# EAGLE design Mother (EAGLE 7.4.0)
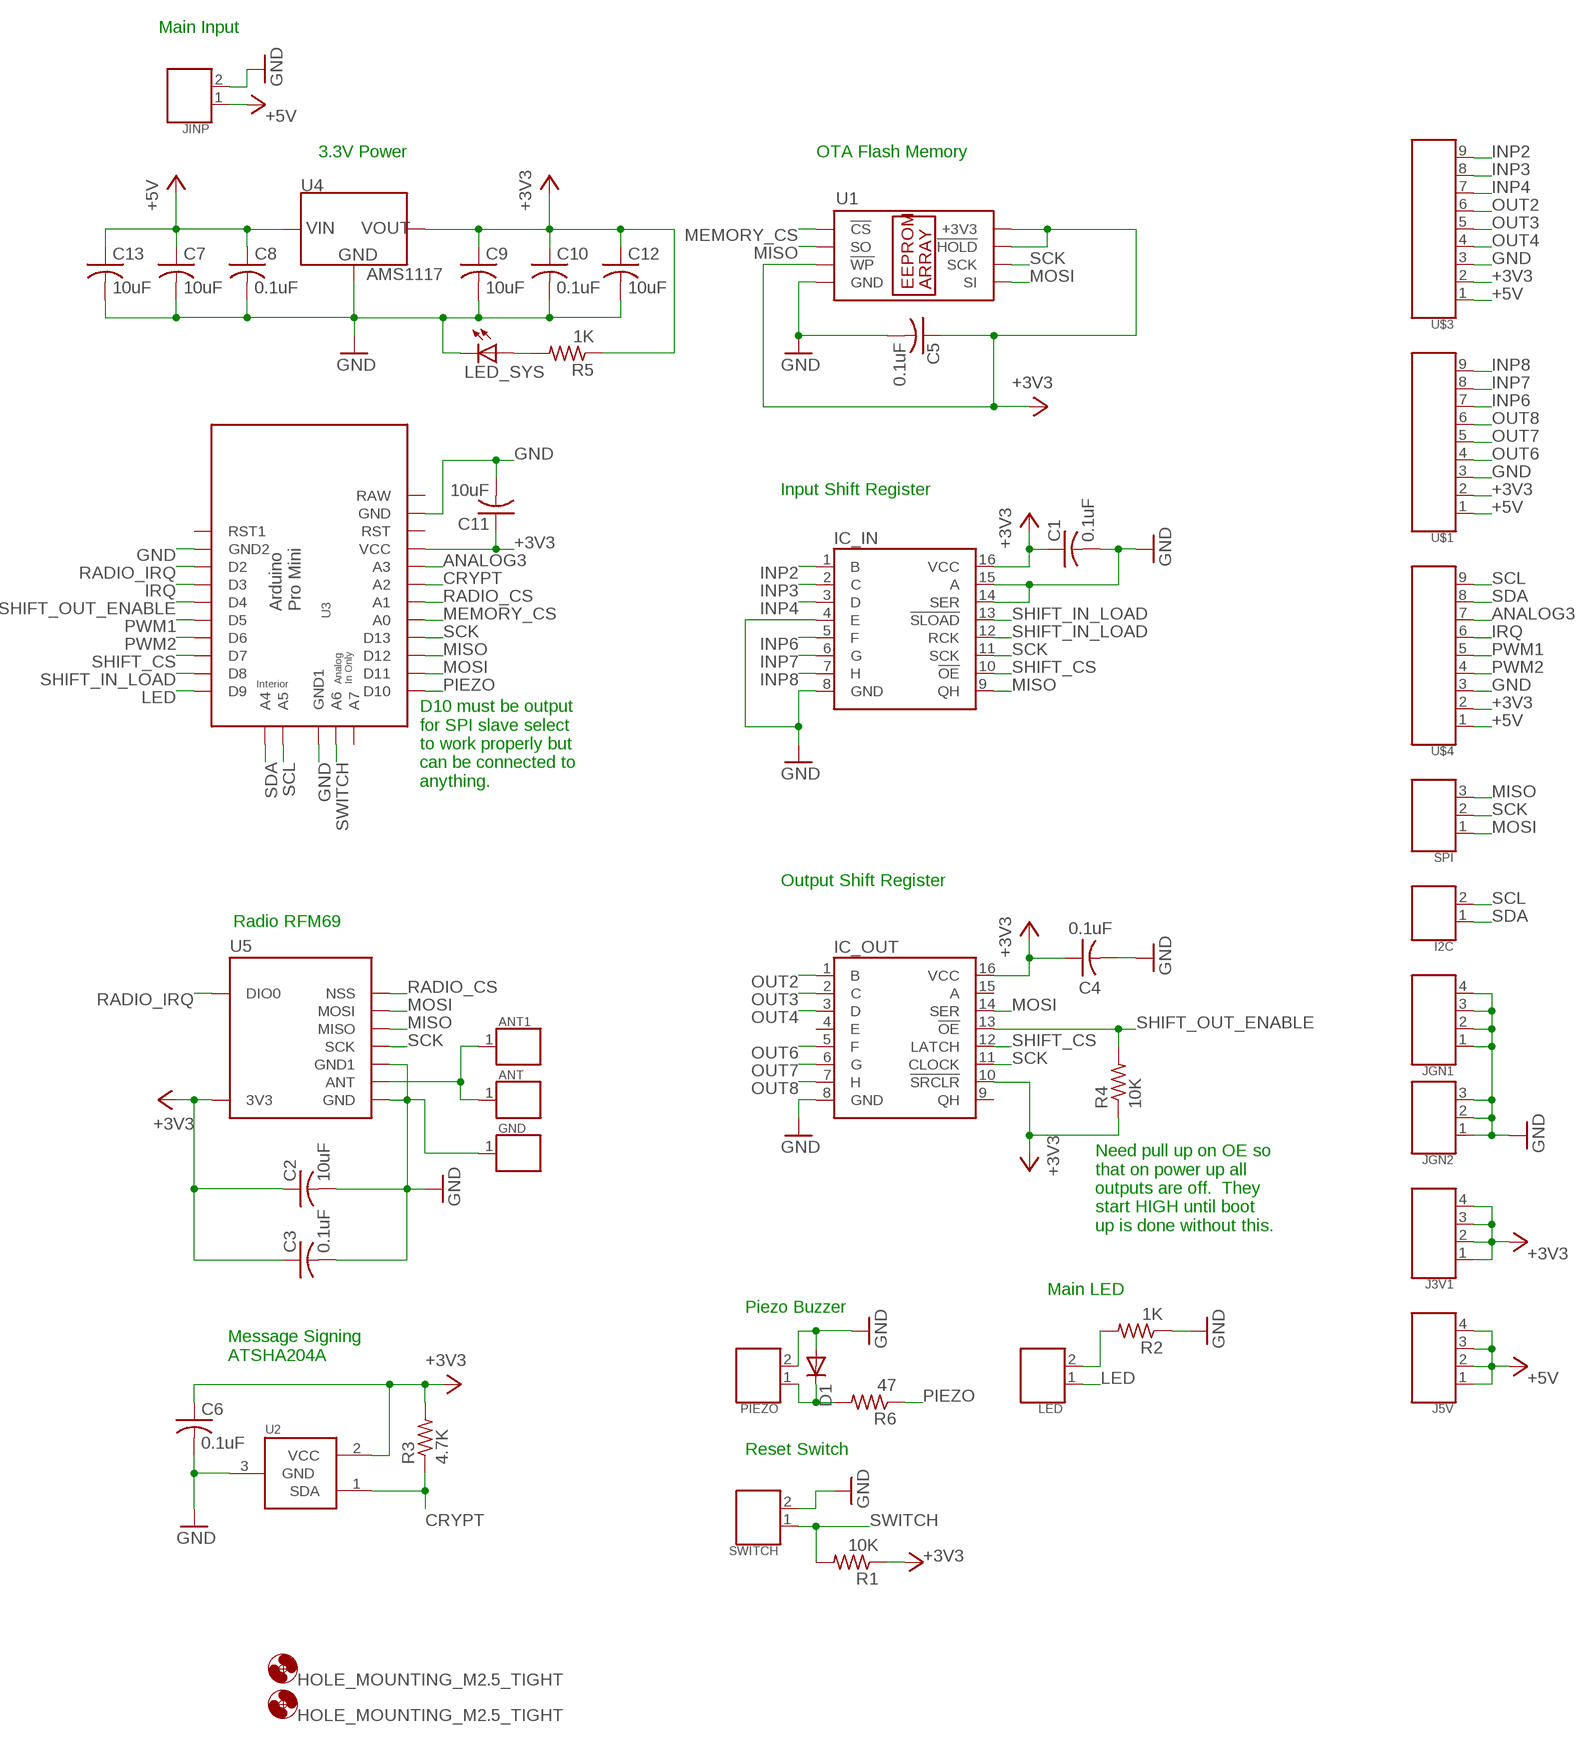
[diagram p0: schematic, sheet 1]

## Parts
ANT  CONNECTOR_1DUPONT  [DUPONT_1]
ANT1  CONNECTOR_1DUPONT  [DUPONT_1]
C1  0.1uF  CAP_0805  [CAP_0805]
C2  10uF  CAP_0805  [CAP_0805]
C3  0.1uF  CAP_0805  [CAP_0805]
C4  0.1uF  CAP_0805  [CAP_0805]
C5  0.1uF  CAP_0805  [CAP_0805]
C6  0.1uF  CAP_0805  [CAP_0805]
C7  10uF  CAP_0805  [CAP_0805]
C8  0.1uF  CAP_0805  [CAP_0805]
C9  10uF  CAP_0805  [CAP_0805]
C10  0.1uF  CAP_0805  [CAP_0805]
C11  10uF  CAP_0805  [CAP_0805]
C12  10uF  CAP_0805  [CAP_0805]
C13  10uF  CAP_0805  [CAP_0805]
D1  DIODESOD323  [SOD323]
GND  CONNECTOR_1DUPONT  [DUPONT_1]
H1  HOLE_MOUNTING_M2.5_TIGHT  [HOLE_M2.5PAN_TIGHT]
H2  HOLE_MOUNTING_M2.5_TIGHT  [HOLE_M2.5PAN_TIGHT]
I2C  CONNECTOR_2DUPONT  [DUPONT_2]
IC_IN  IC_MM74HC589SO16  [SO16]
IC_OUT  IC_SN74HC595  [SO16]
J3V1  CONNECTOR_4DUPONT  [DUPONT_4]
J5V  CONNECTOR_4DUPONT  [DUPONT_4]
JGN1  CONNECTOR_4DUPONT  [DUPONT_4]
JGN2  CONNECTOR_3DUPONT  [DUPONT_3]
JINP  CONNECTOR_2DUPONT  [DUPONT_2]
LED  CONNECTOR_2DUPONT  [DUPONT_2]
LED_SYS  LED  [LED_0805]
PIEZO  CONNECTOR_2DUPONT  [DUPONT_2]
R1  10K  R_0805  [R_0805]
R2  1K  R_0805  [R_0805]
R3  4.7K  R_0805  [R_0805]
R4  10K  R_0805  [R_0805]
R5  1K  R_0805  [R_0805]
R6  47  R_0805  [R_0805]
SPI  CONNECTOR_3DUPONT  [DUPONT_3]
SWITCH  CONNECTOR_2DUPONT  [DUPONT_2]
U1  IC_EEPROM  [SO-08]
U2  IC_ATSHA204A_CRYPT  [SOT23-3]
U3  ARD_PRO_MINI_CLONE_NOPROG  [PRO_MINI_CLONE_NO_PROG]
U4  AMS1117  IC_ASM1117_3.3V  [SOT223]
U5  RADIO_RFM69W_MIN_PAD  [RFM69W_MIN_PAD]
U$1  CONNECTOR_9DUP_MALE90  [DUPONT_MALE90_9]
U$3  CONNECTOR_9DUP_MALE90  [DUPONT_MALE90_9]
U$4  CONNECTOR_9DUPONT  [DUPONT_9]

## Nets
+3V3: C1.1 C2.1 C3.1 C4.1 C5.1 C6.1 C9.1 C10.1 C11.1 C12.1 IC_IN.16(VCC) IC_OUT.10(!SRCLR) IC_OUT.16(VCC) J3V1.1 J3V1.2 J3V1.3 J3V1.4 R1.1 R3.2 R4.1 R5.1 U1.3(!WP) U1.7(!HOLD) U1.8(+3V3) U2.2(VCC) U3.P$19(VCC) U4.2(VOUT) U4.4(VOUT) U5.8(3V3) U$1.2 U$3.2 U$4.2
+5V: C7.1 C8.1 C13.1 J5V.1 J5V.2 J5V.3 J5V.4 JINP.1 U4.3(VIN) U$1.1 U$3.1 U$4.1
ANALOG3: U3.P$18(A3) U$4.7
CRYPT: R3.1 U2.1(SDA) U3.P$17(A2)
GND: C1.2 C2.2 C3.2 C4.2 C5.2 C6.2 C7.2 C8.2 C9.2 C10.2 C11.2 C12.2 C13.2 D1.A GND.1 IC_IN.4(E) IC_IN.8(GND) IC_IN.14(SER) IC_IN.15(A) IC_OUT.8(GND) JGN1.1 JGN1.2 JGN1.3 JGN1.4 JGN2.1 JGN2.2 JGN2.3 JINP.2 LED_SYS.2(C) PIEZO.2 R2.1 SWITCH.2 U1.4(GND) U2.3(GND) U3.P$2(GND2) U3.P$21(GND) U3.P$27(GND1) U4.1(GND) U5.9(GND) U5.11(GND1) U$1.3 U$3.3 U$4.3
INP2: IC_IN.1(B) U$3.9
INP3: IC_IN.2(C) U$3.8
INP4: IC_IN.3(D) U$3.7
INP6: IC_IN.5(F) U$1.7
INP7: IC_IN.6(G) U$1.8
INP8: IC_IN.7(H) U$1.9
IRQ: U3.P$4(D3) U$4.6
LED: LED.1 U3.P$10(D9)
MEMORY_CS: U1.1(!CS) U3.P$15(A0)
MISO: IC_IN.9(QH) SPI.3 U1.2(SO) U3.P$13(D12) U5.13(MISO)
MOSI: IC_OUT.14(SER) SPI.1 U1.5(SI) U3.P$12(D11) U5.14(MOSI)
N$1: LED.2 R2.2
N$2: LED_SYS.1(A) R5.2
N$3: D1.C PIEZO.1 R6.2
N$11: ANT1.1 ANT.1 U5.10(ANT)
OUT2: IC_OUT.1(B) U$3.6
OUT3: IC_OUT.2(C) U$3.5
OUT4: IC_OUT.3(D) U$3.4
OUT6: IC_OUT.5(F) U$1.4
OUT7: IC_OUT.6(G) U$1.5
OUT8: IC_OUT.7(H) U$1.6
PIEZO: R6.1 U3.P$11(D10)
PWM1: U3.P$6(D5) U$4.5
PWM2: U3.P$7(D6) U$4.4
RADIO_CS: U3.P$16(A1) U5.15(NSS)
RADIO_IRQ: U3.P$3(D2) U5.2(DIO0)
SCK: IC_IN.11(SCK) IC_OUT.11(CLOCK) SPI.2 U1.6(SCK) U3.P$14(D13) U5.12(SCK)
SCL: I2C.2 U3.P$24(A5) U$4.9
SDA: I2C.1 U3.P$23(A4) U$4.8
SHIFT_CS: IC_IN.10(!OE) IC_OUT.12(LATCH) U3.P$8(D7)
SHIFT_IN_LOAD: IC_IN.12(RCK) IC_IN.13(!SLOAD) U3.P$9(D8)
SHIFT_OUT_ENABLE: IC_OUT.13(!OE) R4.2 U3.P$5(D4)
SWITCH: R1.2 SWITCH.1 U3.P$26(A6)
Unconnected: IC_OUT.4(E) IC_OUT.9(QH) IC_OUT.15(A) U3.P$1(RST1) U3.P$20(RST) U3.P$25(A7)

## Notes on the sheet
- Main Input
- 3.3V Power | OTA Flash Memory
- Input Shift Register
- D10 must be output
  for SPI slave select
  to work properly but
  can be connected to
  anything.
- Output Shift Register
- Radio RFM69
- Need pull up on OE so
  that on power up all
  outputs are off.  They
  start HIGH until boot
  up is done without this.
- Main LED
- Piezo Buzzer
- Message Signing
  ATSHA204A
- Reset Switch

## Power pins joined to a net without a drawn wire
RAW: U3.P$22(RAW)

## Library data of the parts
ANT ANT1 GND = TD22057:CONNECTOR_1
C1-C13 = TD22057:CAP_0805
D1 = TD22057:DIODE: DIODE high speed (Philips)
H1 H2 = TD22057:HOLE_MOUNTING: MOUNTING HOLE with drill center marker
I2C JINP LED PIEZO SWITCH = TD22057:CONNECTOR_2: 2 Pin connector
IC_IN = TD22057:IC_MM74HC589: MM74HC589 shift input register with SPI support
IC_OUT = TD22057:IC_SN74HC595: SN74Hc595 8 bit ouput shift register Ground: GND, OE VCC: VCC clear all: SRCLR to GND, SRCLR to VCC to use
J3V1 J5V JGN1 = TD22057:CONNECTOR_4
JGN2 SPI = TD22057:CONNECTOR_3
LED_SYS = TD22057:LED
R1-R6 = TD22057:R_0805
U1 = TD22057:IC_EEPROM
U2 = TD22057:IC_ATSHA204A_CRYPT
U3 = TD22057:ARD_PRO_MINI_CLONE_NOPROG: ABK Pro-Mini Arduino Clone
U4 = TD22057:IC_ASM1117_3.3V: ICP006
U5 = TD22057:RADIO_RFM69W_MIN_PAD
U$1 U$3 U$4 = TD22057:CONNECTOR_9

## Board
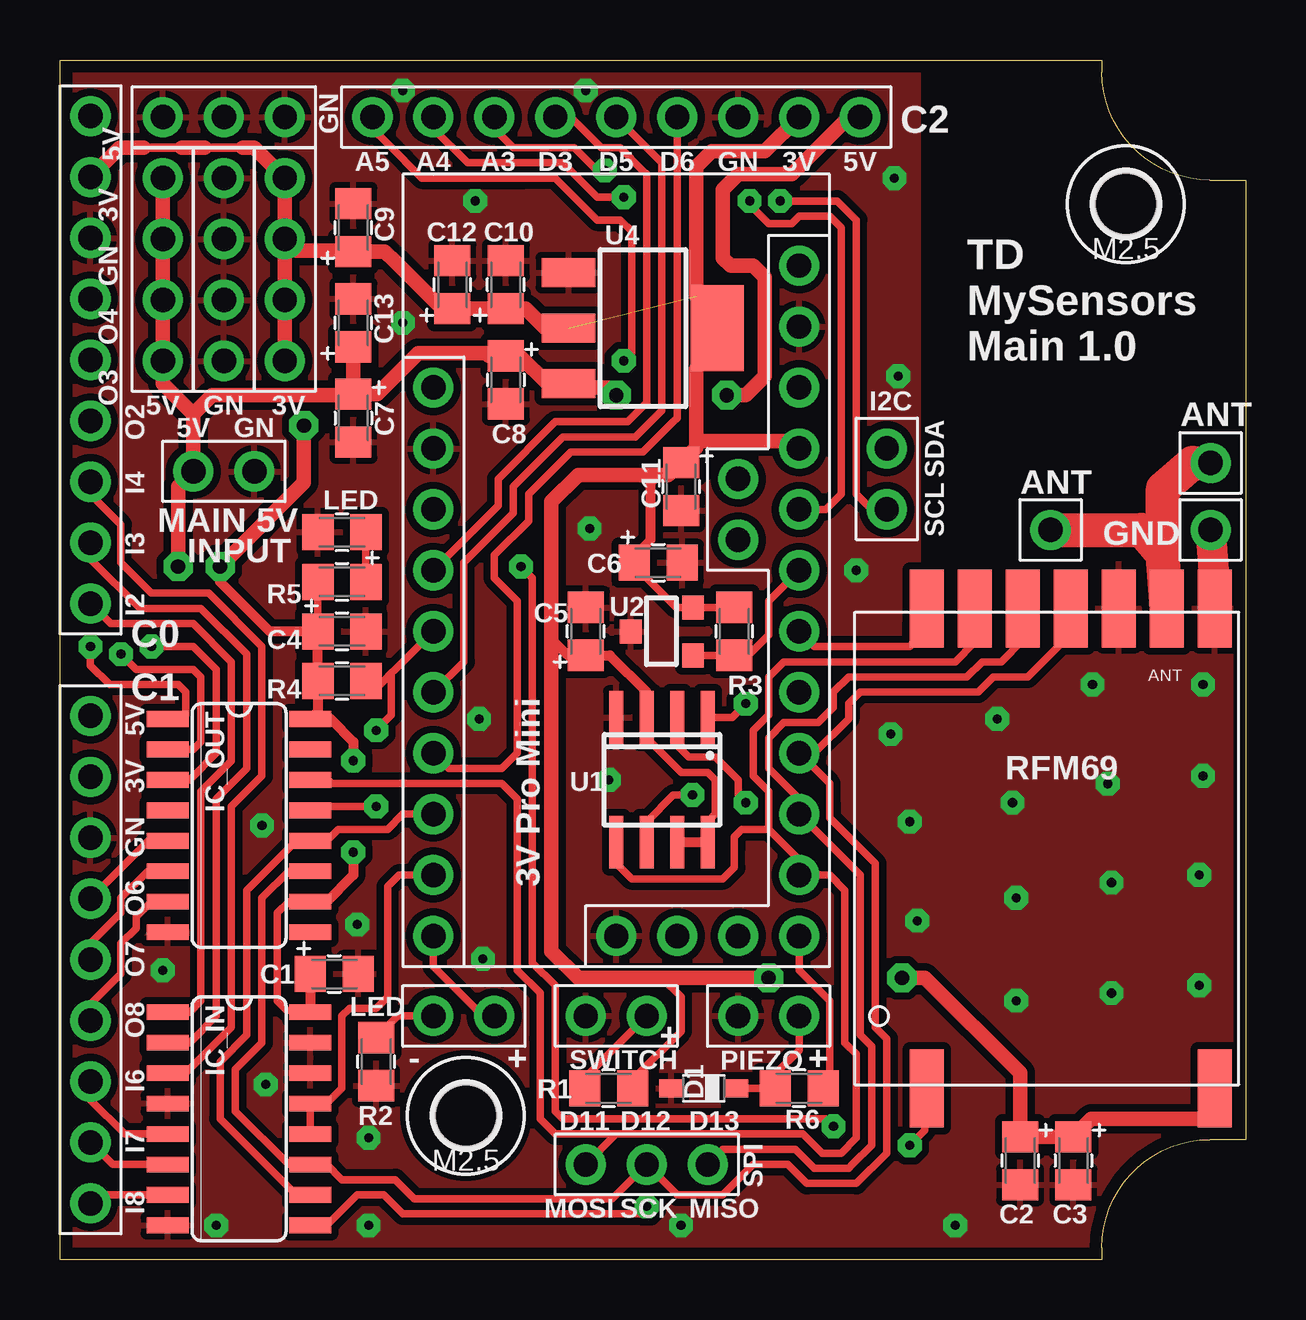
[diagram p1: board, top side]
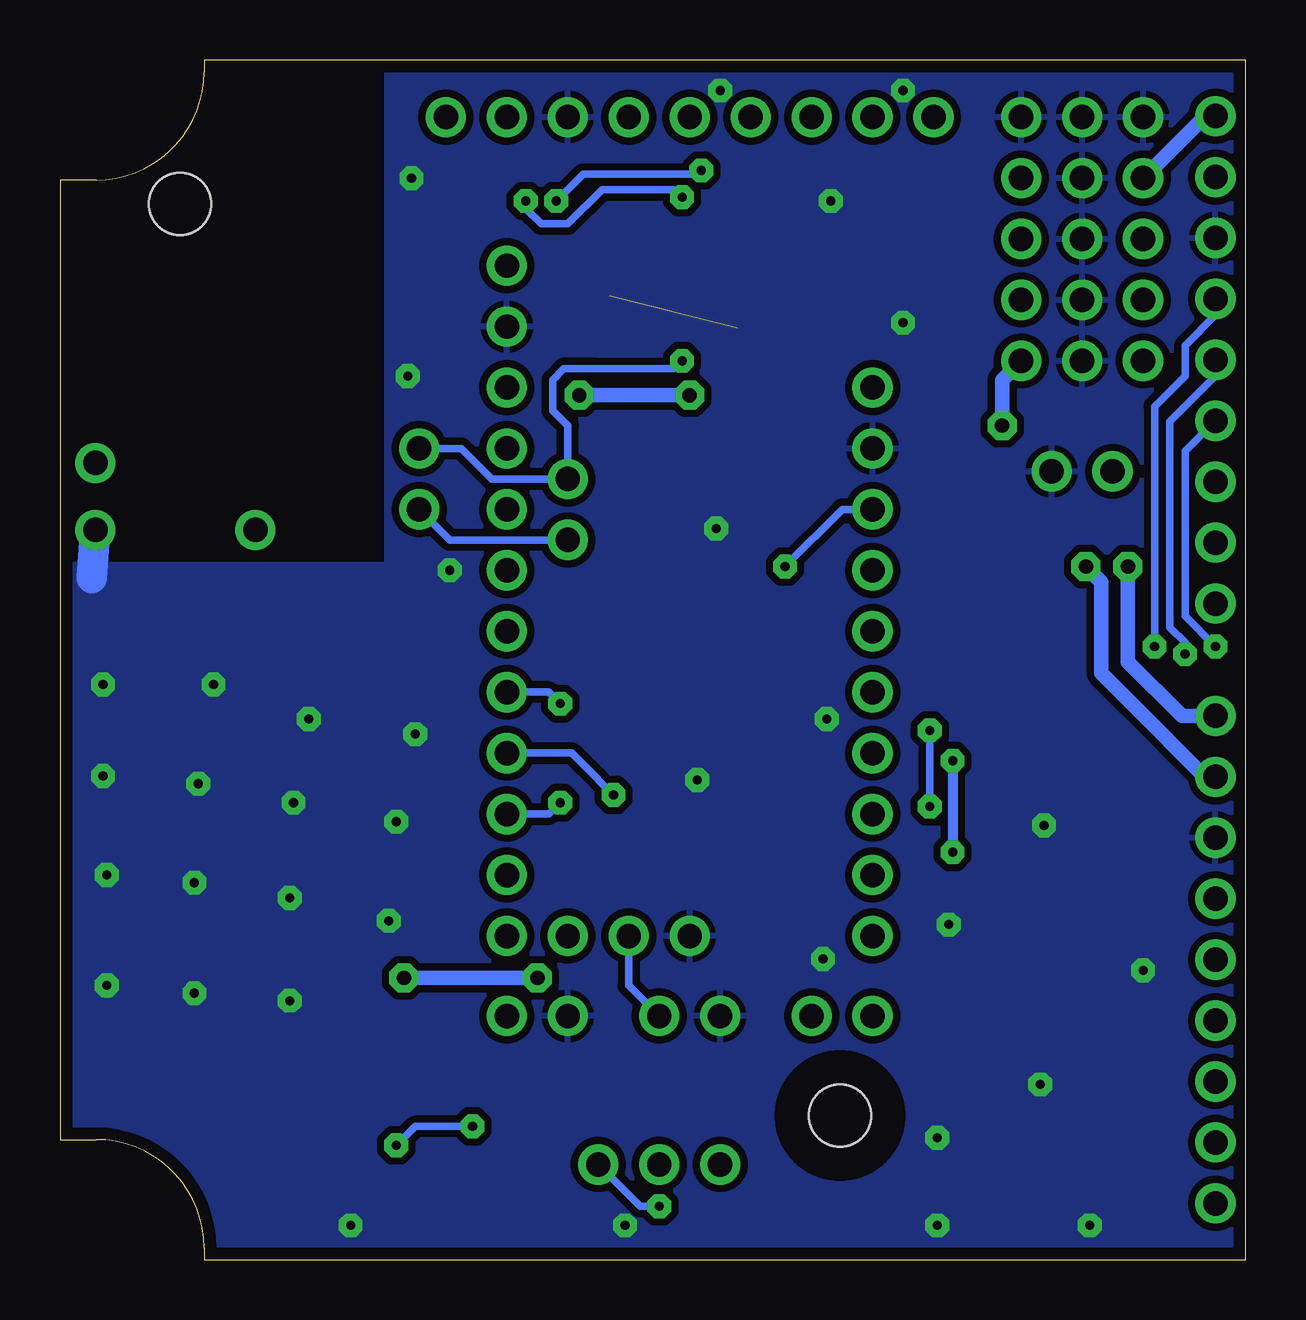
[diagram p2: board, bottom side, seen from below]

Size 49.41 x 50.01 mm. Coordinates in mm from the lower left corner, seen from the top.
Outline: 43.42,0.51 arc-90 47.92,5.01 49.42,5.01 49.42,45.01 47.92,45.01 arc-90 43.42,49.51 43.42,50.01 0,50.01 0,0 43.42,0 43.42,0.51
Copper layers (1*2*15*16): Top 0.035mm / dielectric 0.2mm / layer 2 0.035mm / dielectric 1.2mm / layer 15 0.035mm / dielectric 0.2mm / Bottom 0.035mm
Design rules "tight_electrow_spark": minimum track width 8mil, minimum drill 14mil, track to track 12mil, track to pad 10mil, pad to pad 12mil, via to via 10mil, smd to smd 10mil, copper to edge 20mil, drill to drill 12mil, minimum pad ring 12mil, minimum via ring 12mil, stop-mask expansion 0mil, vias tented up to drill 100mil, thermal gap 10mil

### Footprints (pad centres in the part's own frame; a part is rotated, then mirrored left to right if it is on the bottom)
DUPONT_1 = drill 1.016 pad 1.676: 1 0,0
CAP_0805 = smd 1.3 x 1.5: 1 -1,0; 2 1,0
SOD323 = smd 1 x 0.75: A 1.35,0; C -1.35,0
HOLE_M2.5PAN_TIGHT = hole 2.6: 0,0
DUPONT_2 = drill 1.016 pad 1.676: 1 -1.27,0; 2 1.27,0
SO16 = smd 0.66 x 1.75: 1 -4.445,-2.973; 2 -3.175,-2.973; 3 -1.905,-2.973; 4 -0.635,-2.973; 5 0.635,-2.973; 6 1.905,-2.973; 7 3.175,-2.973; 8 4.445,-2.973; 9 4.445,2.973; 10 3.175,2.973; 11 1.905,2.973; 12 0.635,2.973; 13 -0.635,2.973; 14 -1.905,2.973; 15 -3.175,2.973; 16 -4.445,2.973
DUPONT_4 = drill 1.016 pad 1.676: 1 -3.81,0; 2 -1.27,0; 3 1.27,0; 4 3.81,0
DUPONT_3 = drill 1.016 pad 1.676: 1 -2.54,0; 2 0,0; 3 2.54,0
LED_0805 = smd 1.3 x 1.5: 1 -1,0; 2 1,0
R_0805 = smd 1.3 x 1.5: 1 -1,0; 2 1,0
SO-08 = smd 0.6 x 2.2: 1 -1.905,-2.6; 2 -0.635,-2.6; 3 0.635,-2.6; 4 1.905,-2.6; 5 1.905,2.6; 6 0.635,2.6; 7 -0.635,2.6; 8 -1.905,2.6
SOT23-3 = smd 1 x 0.9: 1 -1,-1.3; 2 1,-1.3; 3 0,1.3
PRO_MINI_CLONE_NO_PROG = drill 1.016 pad 1.676: P$1 0,22.86; P$2 0,20.32; P$3 0,17.78; P$4 0,15.24; P$5 0,12.7; P$6 0,10.16; P$7 0,7.62; P$8 0,5.08; P$9 0,2.54; P$10 0,0; P$11 15.24,0; P$12 15.24,2.54; P$13 15.24,5.08; P$14 15.24,7.62; P$15 15.24,10.16; P$16 15.24,12.7; P$17 15.24,15.24; P$18 15.24,17.78; P$19 15.24,20.32; P$20 15.24,22.86; P$21 15.24,25.4; P$22 15.24,27.94; P$23 12.7,16.51; P$24 12.7,19.05; P$25 12.7,0; P$26 10.16,0; P$27 7.62,0
SOT223 = smd 1.219 x 2.235: 1 -2.311,-3.099; 2 0,-3.099; 3 2.311,-3.099 | smd 3.6 x 2.2: 4 0,3.099
RFM69W_MIN_PAD = smd 3.25 x 1.4: 2 -10,5; 8 -10,-7; 9 10,-7; 10 10,-5; 11 10,-3; 12 10,-1; 13 10,1; 14 10,3; 15 10,5
DUPONT_MALE90_9 = drill 1.016 pad 1.676: 1 -10.16,0; 2 -7.62,0; 3 -5.08,0; 4 -2.54,0; 5 0,0; 6 2.54,0; 7 5.08,0; 8 7.62,0; 9 10.16,0
DUPONT_9 = drill 1.016 pad 1.676: 1 -10.16,0; 2 -7.62,0; 3 -5.08,0; 4 -2.54,0; 5 0,0; 6 2.54,0; 7 5.08,0; 8 7.62,0; 9 10.16,0

### Placement (x,y rotation side)
ANT  47.94,33.21 0 top
ANT1  41.28,30.42 0 top
C1  11.43,11.91 0 top
C2  40.01,4.13 270 top
C3  42.23,4.13 270 top
C4  11.75,26.19 0 top
C5  21.91,26.19 90 top
C6  24.92,29.05 0 top
C7  12.22,35.08 270 top
C8  18.57,36.67 270 top
C9  12.22,43.02 90 top
C10  18.57,40.64 90 top
C11  25.88,32.23 270 top
C12  16.35,40.64 90 top
C13  12.22,39.05 90 top
D1  26.83,7.14 180 top
GND  47.94,30.42 0 top
H1  16.91,6.01 0 top
H2  44.41,44.01 0 top
I2C  34.45,32.54 90 top
IC_IN  7.46,5.87 270 top
IC_OUT  7.46,18.1 270 top
J3V1  9.37,41.27 270 top
J5V  4.29,41.27 90 top
JGN1  6.83,41.27 90 top
JGN2  6.83,47.62 0 top
JINP  6.83,32.86 0 top
LED  16.83,10.16 180 top
LED_SYS  11.75,30.32 180 top
PIEZO  29.53,10.16 180 top
R1  22.86,7.14 180 top
R2  13.18,8.26 90 top
R3  28.1,26.19 90 top
R4  11.75,24.13 0 top
R5  11.75,28.26 0 top
R6  30.8,7.14 180 top
SPI  24.45,3.97 0 top
SWITCH  23.18,10.16 180 top
U1  25.08,20 180 top
U2  25.08,26.19 90 top
U3  15.56,13.49 0 top
U4  24.29,38.83 270 top
U5  41.12,17.14 90 top
U$1  1.27,12.51 270 top
U$3  1.27,37.51 270 top
U$4  23.18,47.62 180 top

### Tracks (layer width: path | path; a pad name or v marks a point on that pad's centre or on a via)
+3V3  (via drill 0.38 pad 0.99, 0.6 pad 1.21)  (1 unrouted)
  Top 0.305: U1.3 24.45,21.75 25.88,20.32 26.99,20.32 27.31,20 27.31,18.57 26.99,18.26 U1.8 | IC_OUT.10 9.53,14.92 9.05,14.45 9.05,10.79 9.46,10.39 10.37,10.39 | R1.1 24.02,7.67 25.88,9.53 25.88,10.79 25.88,10.95 25.08,11.75 | 23.92,29.32 C6.1 23.92,28.94 25.56,27.3 25.67,27.19 U2.2 | 26.34,27.15 U2.2 | U2.2 R3.2 | R5.1 C4.1
  Top 0.356: 7.62,46.35 6.03,46.35 | 5.08,46.35 3.49,46.35
  Top 0.406: U1.8 U1.7 | v12.22,16.99 12.22,16.03 11.11,14.92 IC_OUT.10 | 10.53,10.41 IC_IN.16 | 10.37,10.39 IC_IN.16 | v12.22,20.8 12.22,21.59 11.27,22.54 IC_OUT.16 10.75,22.86 R4.1 C4.1 8.73,26.19 6.67,28.26 v6.67,28.89 | C1.1 IC_IN.16 | C6.1 23.92,29.32 | 23.92,29.32 23.92,29.48 | 23.92,29.32 24.61,30 24.61,32.38 24.92,32.7 | U1.3 24.45,23.65 22.91,25.19 C5.1 21.16,25.19 20.48,25.88
  Top 0.61: J3V1.4 J3V1.3 9.37,42.07 J3V1.2 | J3V1.2 J3V1.1 8.1,46.35 7.62,46.35 | 48.02,7.3 U5.8 48.26,7 48.26,6.51 47.63,5.87 46.04,5.87 42.97,5.87 C3.1 C2.1 40.01,7.78 36.04,11.75 v35.08,11.75 | 27.31,39.69 27.31,39.37 | 27.31,39.37 27.31,38.91 U4.4 | U4.4 27.15,38.59 27.15,37.78 26.51,37.15 26.51,34.77 26.51,33.97 | 26.67,38.11 U4.4 | v10.16,34.77 10.16,32.38 v6.67,28.89 | U4.2 20.23,38.83 19.42,39.64 C10.1 C12.1 15.92,39.64 13.97,41.59 13.54,42.02 C9.1 12.18,42.07 9.84,42.07 J3V1.2 | v29.53,11.75 25.88,11.75 25.08,11.75 21.59,11.75 20.48,12.86 20.48,25.88 20.48,26.04 20.48,27.15 20.48,31.59 21.59,32.7 24.45,32.7 24.77,32.7 24.92,32.7 25.35,32.7 C11.1 26.51,33.86 26.51,33.97 | U3.P$19 30.48,34.13 26.99,34.13 26.67,34.13 26.51,33.97 | U$4.2 29.37,46.2 27.15,46.2 26.51,45.56 26.51,40.16 27.31,39.37 | 6.03,46.35 5.08,46.35 | 3.49,46.35 2.5,46.35 U$3.2
  Bottom 0.406: v12.22,20.8 v12.22,16.99
  Bottom 0.61: v29.53,11.75 v35.08,11.75 | U$1.2 1.71,20.13 4.76,23.18 6.03,24.45 6.03,28.1 6.03,28.26 v6.67,28.89 | v10.16,34.77 10.16,36.67 J3V1.4
+5V  (via drill 0.6 pad 1.21)
  Top 0.61: J5V.2 J5V.3 J5V.4 J5V.1 4.29,36.51 5.56,35.24 | 5.56,35.24 JINP.1 4.92,32.23 v4.92,28.89 | v27.78,36.04 28.58,36.04 29.37,36.83 29.37,40.96 28.89,41.43 27.94,41.43 27.62,41.75 27.62,44.61 27.78,44.77 28.26,45.24 30.48,45.24 32.86,47.62 U$4.1 | v23.18,36.04 22.86,36.35 21.36,36.35 U4.3 20.32,36.51 19.16,37.67 C8.1 17.89,37.67 17.78,37.78 14.92,37.78 13.81,36.67 13.22,36.08 C7.1 | 5.56,35.24 6.35,36.04 11.86,36.04 C7.1 | C13.1 C7.1
  Bottom 0.61: U$1.1 2.67,22.67 4.92,24.92 v4.92,28.89 | v27.78,36.04 v23.18,36.04 | U$3.1 1.7,47.67 J5V.4
ANALOG3  (via drill 0.38 pad 0.99)
  Top 0.305: v28.73,44.13 28.73,43.97 29.53,43.18 30.48,43.18 30.8,43.5 32.07,43.5 32.54,43.02 32.54,31.91 31.91,31.27 U3.P$18 | U$4.7 18.1,47.15 18.89,46.35 19.05,46.35 20.16,46.35 21.43,46.35 22.38,45.4 v22.7,45.4
  Bottom 0.305: v28.73,44.13 27.62,45.24 22.86,45.24 v22.7,45.4
CRYPT
  Top 0.305: U2.1 R3.1 | R3.1 28.37,25.19 | U3.P$17 29.53,27.46 29.53,26.99 29.53,26.04 28.58,25.08 28.21,25.08 R3.1
GND  (via drill 0.38 pad 0.99)
  Top 1.27: GND.1 48.1,28.42
  Bottom 1.27: 48.1,28.42 47.94,30.48
  other vias: 43.02,23.97 47.62,23.97 47.62,20.16 43.66,19.84 39.69,19.05 47.47,11.43 43.82,11.11 39.85,10.79 22.86,20 22.07,30.48 17.46,22.54 47.47,16.03 43.82,15.72 39.85,15.08 35.4,18.26 35.72,14.13 37.31,1.43 4.29,12.06 6.51,1.43 33.18,28.73 12.38,13.97 17.62,12.54 17.3,44.13 8.57,7.3 34.93,36.83 34.77,45.09 25.88,1.43 14.29,48.74 12.86,1.43 39.05,22.54 34.61,21.91 21.91,48.74 12.86,5.08 8.41,18.1 14.29,39.05
  pour Top (isolate 0.305): 0,50.01 0,0 43.46,0 43.46,0.95 arc-92 47.62,4.94 49.45,4.94 49.45,28.98 35.77,28.98 35.77,50.01
  pour Bottom (isolate 0.305): 0,50.01 0,0 43.46,0 43.46,0.95 arc-92 47.62,4.94 49.45,4.94 49.45,28.98 35.77,28.98 35.77,50.01
INP2
  Top 0.305: IC_IN.1 5.4,10.32 5.87,10.79 5.87,19.53 7.14,20.8 7.14,24.92 5.56,26.51 2.11,26.51 U$3.9
INP3
  Top 0.305: 1.27,29.53 U$3.8 1.27,29.21 3.33,27.15 5.87,27.15 7.78,25.24 7.78,20.48 6.51,19.21 6.51,10.16 5.4,9.05 IC_IN.2
INP4
  Top 0.305: U$3.7 1.27,31.91 2.54,30.64 2.54,29.05 3.81,27.78 6.19,27.78 8.41,25.56 8.41,20.16 7.14,18.89 7.14,9.68 5.24,7.78 IC_IN.3
INP6
  Top 0.305: U$1.7 1.27,6.67 2.7,5.24 IC_IN.5
INP7
  Top 0.305: U$1.8 2.19,3.97 IC_IN.6
INP8
  Top 0.305: U$1.9 1.62,2.7 IC_IN.7
IRQ
  Top 0.305: U3.P$4 18.26,31.43 18.26,32.54 20.64,34.92 23.65,34.92 23.97,35.24 24.29,35.56 24.45,35.72 24.45,44.45 24.45,45.24 24.29,45.4 23.34,46.35 22.7,46.35 22.54,46.35 21.27,47.62 U$4.6
LED
  Top 0.305: U3.P$10 15.56,12.22 17.62,10.16 LED.1
MEMORY_CS  (via drill 0.38 pad 0.99)
  Top 0.305: U1.1 27.84,22.6 28,22.6 v28.58,23.18
  Bottom 0.305: v28.58,23.18 29.05,23.65 U3.P$15
MISO  (via drill 0.38 pad 0.99)
  Top 0.305: U1.2 25.72,21.43 26.19,20.95 27.31,20.95 28.26,20 28.26,19.37 v28.58,19.05 | U5.13 40.12,25.83 39.21,24.92 38.42,24.92 37.78,24.29 32.86,24.29 32.23,23.65 32.23,23.02 31.59,22.38 30.32,22.38 30.16,22.38 29.53,21.75 29.53,21.59 29.53,20.64 29.53,20.48 30.8,19.21 U3.P$13 33.34,16.03 33.34,9.53 33.34,9.37 33.81,8.89 33.81,4.92 33.81,4.76 33.02,3.97 32.86,3.81 31.43,3.81 30.64,4.6 27.62,4.6 SPI.3 | IC_IN.9 11.11,1.43 12.38,2.7 13.49,2.7 14.29,1.91 23.5,1.91 24.13,1.91 v24.45,2.22
  Bottom 0.305: v24.45,2.22 25.24,2.22 SPI.3 | U3.P$13 29.05,18.57 v28.58,19.05
MOSI
  Top 0.305: U5.14 38.1,27.19 38.1,25.72 37.31,24.92 30.32,24.92 30.16,24.92 29.53,24.29 29.53,24.13 29.53,22.7 28.89,22.07 28.89,21.91 28.89,20.32 28.89,20.16 29.53,19.53 29.53,18.73 29.53,17.94 | U1.5 23.18,16.51 23.81,15.88 27.62,15.88 28.1,16.35 28.1,17.14 28.1,17.62 28.42,17.94 29.53,17.94 | 10.59,19.84 IC_OUT.14 11.01,20.16 11.33,19.84 18.42,19.84 19.05,19.21 19.05,12.06 20,11.11 20,9.21 20,5.87 20.64,5.24 21.75,5.24 23.18,5.24 | SPI.1 23.18,5.24 | 23.18,5.24 23.5,5.24 27.78,5.24 30.96,5.24 31.75,4.45 32.54,4.45 33.18,5.08 33.18,8.57 32.7,9.05 32.7,15.4 32.07,16.03 U3.P$12 30.8,16.67 29.53,17.94
N$1
  Top 0.305: LED.2 14.08,10.16 R2.2
N$2
  Top 0.305: LED_SYS.1 R5.2
N$3
  Top 0.305: D1.C R6.2 29.85,7.19 29.85,7.78 30.8,8.73 PIEZO.1
N$11
  Top 1.422: U5.10 45.96,29.37 | 45.96,29.37 45.96,32.15 47.18,33.21 ANT.1 | ANT1.1 45.07,30.42 45.96,29.37
OUT2  (via drill 0.38 pad 0.99)
  Top 0.305: 4.92,22.54 IC_OUT.1 5.08,22.54 5.24,22.7 5.24,23.65 4.92,23.97 2.06,23.97 1.27,24.77 v1.27,25.56
  Bottom 0.305: v1.27,25.56 2.54,26.83 2.54,33.7 U$3.6
OUT3  (via drill 0.38 pad 0.99)
  Top 0.305: IC_OUT.2 5.56,21.27 5.87,21.59 5.87,24.29 5.56,24.61 3.18,24.61 v2.54,25.24
  Bottom 0.305: v2.54,25.24 2.54,25.72 3.18,26.35 3.18,34.92 1.27,36.83 U$3.5
OUT4  (via drill 0.38 pad 0.99)
  Top 0.305: IC_OUT.3 5.4,20 6.51,21.11 6.51,24.61 5.56,25.56 v3.81,25.56
  Bottom 0.305: v3.81,25.56 3.81,35.56 2.54,36.83 2.54,38.1 1.27,39.37 U$3.4
OUT6
  Top 0.305: IC_OUT.5 3.69,17.46 U$1.4
OUT7
  Top 0.305: IC_OUT.6 3.65,16.19 2.54,15.08 2.54,14.45 1.27,13.18 U$1.5
OUT8
  Top 0.305: U$1.6 1.27,10.64 2.54,11.91 2.54,13.18 3.18,13.81 3.18,14.29 3.81,14.92 IC_OUT.7
PIEZO
  Top 0.305: 32.07,7.25 R6.1 32.07,7.25 | U3.P$11 30.8,12.06 32.07,10.79 32.07,7.25
PWM1
  Top 0.305: U3.P$6 16.83,24.92 16.83,29.05 18.89,31.11 18.89,32.23 20.96,34.29 23.97,34.29 24.92,35.24 25.08,35.4 25.08,45.09 25.08,45.72 24.92,45.88 U$4.5
PWM2
  Top 0.305: U3.P$7 16.19,20.48 18.42,20.48 19.05,21.11 19.05,27.46 18.1,28.42 18.1,29.37 19.53,30.8 19.53,31.91 21.27,33.66 24.29,33.66 25.56,34.92 25.72,35.08 U$4.4
RADIO_CS
  Top 0.305: U3.P$16 31.43,25.56 35.4,25.56 35.56,25.72 35.56,26.59 U5.15
RADIO_IRQ  (via drill 0.38 pad 0.99)
  Top 0.305: 19.53,28.57 v19.21,28.89 19.69,28.42 19.69,12.38 20.64,11.43 20.64,9.53 20.64,6.19 20.96,5.87 22.23,5.87 28.1,5.87 31.91,5.87 v32.23,5.56 | U5.2 36.04,7.07 36.04,5.4 v35.4,4.76
  Bottom 0.305: v19.21,28.89 16.83,31.27 U3.P$3 | v32.23,5.56 34.61,5.56 v35.4,4.76
SCK  (via drill 0.38 pad 0.99)
  Top 0.305: U1.6 24.45,18.26 25.56,19.37 v26.35,19.37 | 42.12,26.24 U5.12 41.59,26.62 41.59,25.56 40.32,24.29 38.89,24.29 38.26,23.65 33.34,23.65 32.86,23.18 32.86,22.54 31.43,21.11 U3.P$14 32.07,19.84 32.07,19.05 32.07,18.41 33.97,16.51 33.97,9.84 33.97,9.68 34.45,9.21 34.45,4.45 33.18,3.17 31.12,3.17 30.32,3.97 28.89,3.97 27.62,2.7 27.46,2.7 26.04,2.7 | IC_OUT.11 9.53,16.19 8.41,15.08 8.41,9.05 7.3,7.94 7.3,6.19 9.53,3.97 IC_IN.11 11.11,3.97 11.75,3.33 13.97,3.33 14.76,2.54 23.02,2.54 SPI.2 25.72,2.7 26.04,2.7 | 26.35,2.7 26.04,2.7
  Bottom 0.305: v26.35,19.37 27.62,20.64 28.1,21.11 U3.P$14
SCL  (via drill 0.38 pad 0.99)
  Top 0.305: 23.81,37.78 v23.5,37.47 23.81,37.78 | 15.56,45.09 16.19,45.09 | 16.19,45.09 19.37,45.09 20.64,45.09 22.38,43.34 23.34,43.34 23.81,42.86 23.81,37.78 | U$4.9 13.02,47.15 13.65,46.51 15.08,45.09 16.19,45.09
  Bottom 0.305: v23.5,37.47 23.81,37.15 27.15,37.15 28.42,37.15 28.89,36.67 28.89,35.4 28.26,34.77 U3.P$24 31.12,32.54 31.27,32.54 31.43,32.54 32.7,33.81 I2C.2
SDA  (via drill 0.38 pad 0.99)
  Top 0.305: v23.5,44.29 22.54,44.29 22.38,44.29 20.96,45.72 19.69,45.72 16.99,45.72 15.56,47.15 U$4.8 | v30,44.13 32.39,44.13 33.18,43.34 33.18,31.91 33.81,31.27 I2C.1
  Bottom 0.305: v23.5,44.29 23.81,44.61 26.83,44.61 28.26,43.18 29.05,43.18 29.37,43.18 30,43.81 v30,44.13 | U3.P$23 33.18,30 I2C.1
SHIFT_CS
  Top 0.305: U3.P$8 14.29,18.57 13.65,17.94 11.59,17.94 11.11,17.46 IC_OUT.12 9.84,17.46 7.78,15.4 7.78,9.37 6.67,8.26 6.67,5.87 9.84,2.7 IC_IN.10
SHIFT_IN_LOAD
  Top 0.305: U3.P$9 14.13,16.03 13.65,15.56 13.65,10.95 13.18,10.48 12.07,10.48 11.75,10.16 11.75,7.14 11.11,6.51 IC_IN.13 IC_IN.12
SHIFT_OUT_ENABLE  (via drill 0.38 pad 0.99)
  Top 0.305: v13.18,18.89 10.59,18.89 IC_OUT.13 | v13.18,22.07 13.81,22.7 13.81,24.45 | U3.P$5 13.97,24.61 13.81,24.45 | 13.81,24.45 13.49,24.13 13.18,23.81 12.86,24.13 R4.2
  Bottom 0.305: v13.18,18.89 v13.18,22.07
SWITCH
  Top 0.305: SWITCH.1 22.02,7.73 R1.2
  Bottom 0.305: U3.P$26 25.72,11.43 SWITCH.1

### Text on the board
tPlace: GN | C2 | 5V | A5 | A4 | A3 | D3 | D5 | D6 | GN | 3V | 5V | 3V | GN | O4 | TD / MySensors / Main 1.0 | O3 | 5V | GN | 3V | O2 | I2C | 5V | GN | SDA | I4 | ANT | LED | SCL | I3 | MAIN 5V | INPUT | I2 | C0 | C1 | 5V | 3V | RFM69 | GN | 3V Pro Mini | O6 | O7 | O8 | + | - | + | SWITCH | + | I6 | I7 | D11 | D12 | D13 | I8 | MOSI | SCK | MISO
tNames: IC_OUT | IC_IN